# EAGLE design mojo-basler-shield (EAGLE 8.6.1)
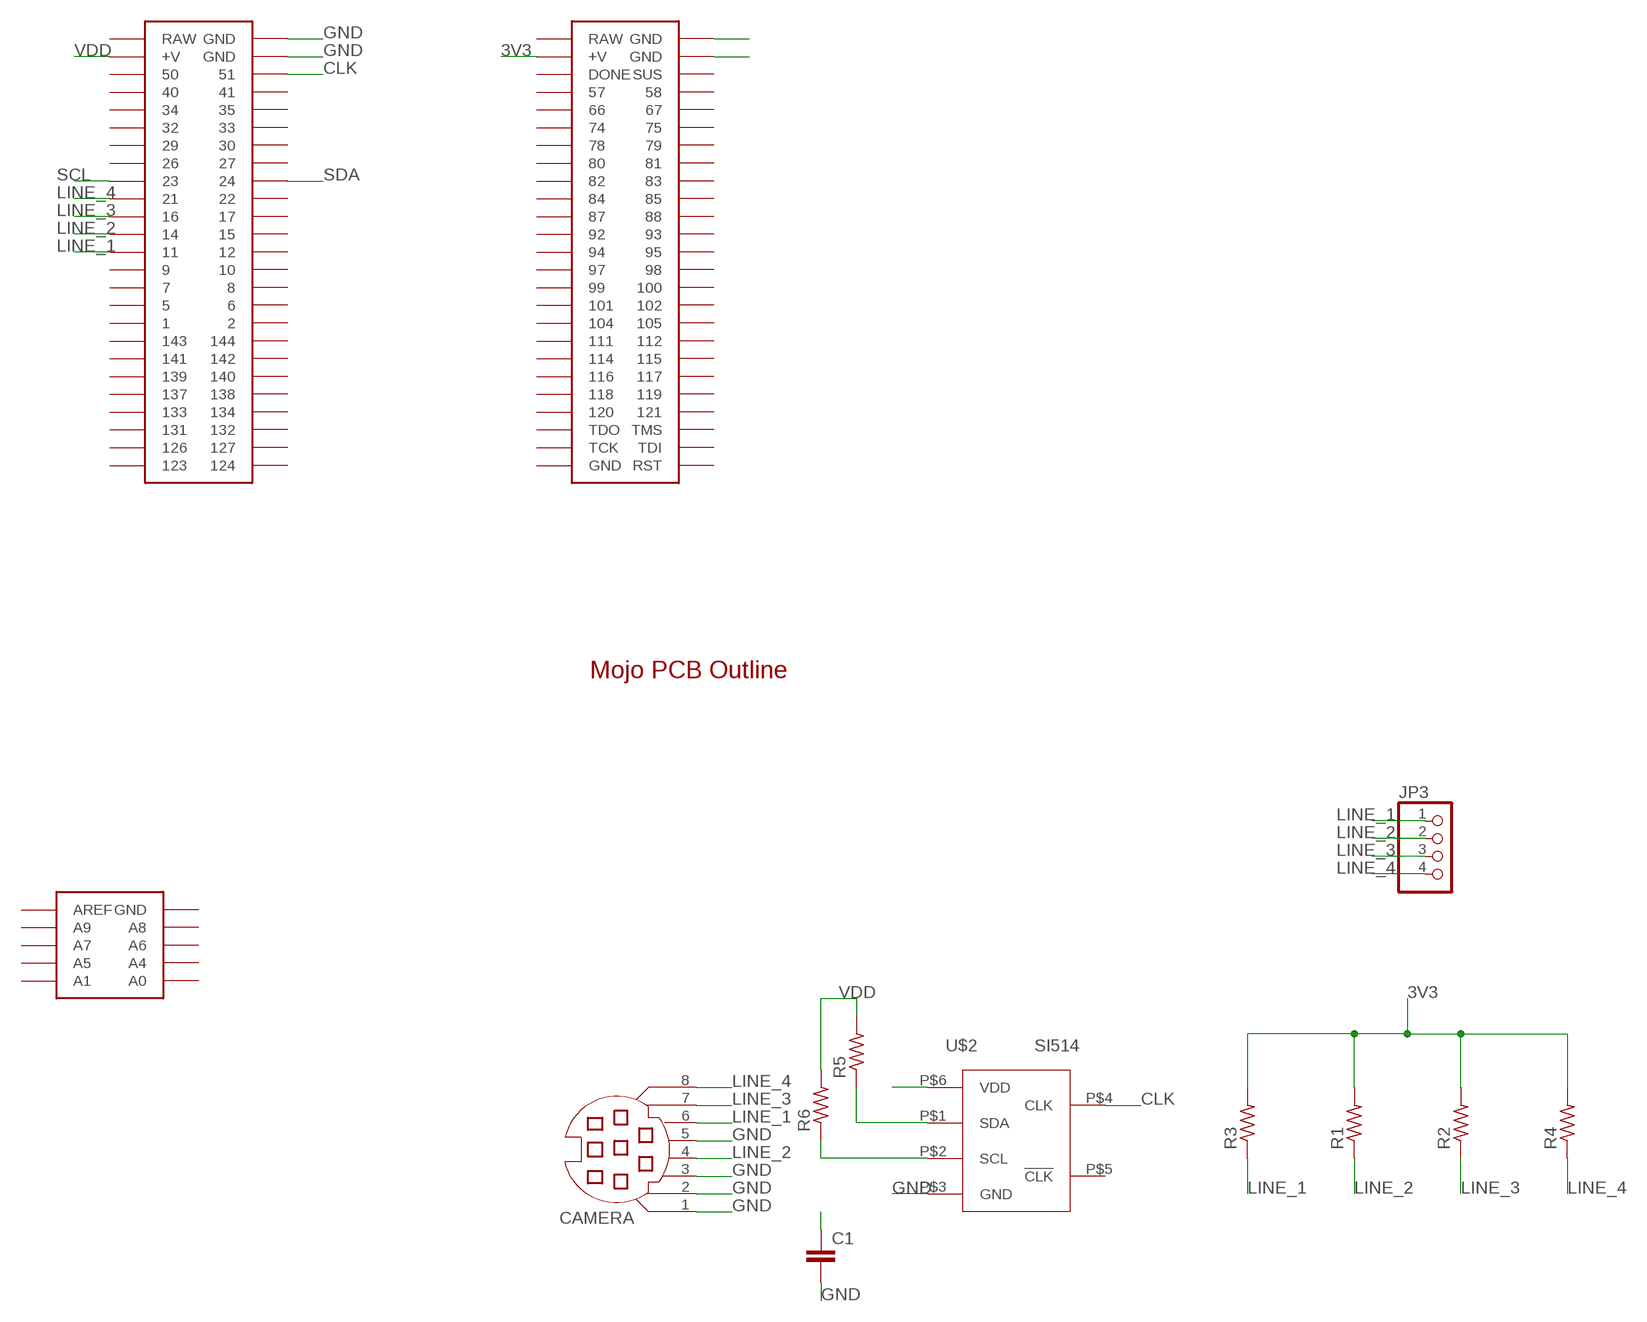
[diagram p0: schematic, sheet 1]

## Parts
C1  C-EUC0603  [C0603]
CAMERA  MD08SS  [MDIN08SS]
JP3  PINHD-1X4  [1X04]
R1  R-US_R0603  [R0603]
R2  R-US_R0603  [R0603]
R3  R-US_R0603  [R0603]
R4  R-US_R0603  [R0603]
R5  R-US_R0603  [R0603]
R6  R-US_R0603  [R0603]
U$1  MOJO_OUTLINE  [MOJO_OUTLINE]
U$2  SI514  [XTAL-6PIN]
U$3  MOJOV3  [MOJO_V3]

## Nets
3V3: R1.2 R2.2 R3.2 R4.2 U$3.V@2(+V)
CLK: U$2.P$4(CLK) U$3.51
GND: C1.2 CAMERA.1 CAMERA.2 CAMERA.3 CAMERA.5 U$2.P$3(GND) U$3.GND@1(GND) U$3.GND@2(GND) U$3.GND@3(GND) U$3.GND@4(GND)
LINE_1: CAMERA.6 JP3.1 R3.1 U$3.11
LINE_2: CAMERA.4 JP3.2 R1.1 U$3.14
LINE_3: CAMERA.7 JP3.3 R2.1 U$3.16
LINE_4: CAMERA.8 JP3.4 R4.1 U$3.21
SCL: R6.1 U$2.P$2(SCL) U$3.23
SDA: R5.1 U$2.P$1(SDA) U$3.24
VDD: C1.1 R5.2 R6.2 U$2.P$6(VDD) U$3.V@1(+V)
Unconnected: U$2.P$5(!CLK) U$3.1 U$3.2 U$3.5 U$3.6 U$3.7 U$3.8 U$3.9 U$3.10 U$3.12 U$3.15 U$3.17 U$3.22 U$3.26 U$3.27 U$3.29 U$3.30 U$3.32 U$3.33 U$3.34 U$3.35 U$3.40 U$3.41 U$3.50 U$3.57 U$3.58 U$3.66 U$3.67 U$3.74 U$3.75 U$3.78 U$3.79 U$3.80 U$3.81 U$3.82 U$3.83 U$3.84 U$3.85 U$3.87 U$3.88 U$3.92 U$3.93 U$3.94 U$3.95 U$3.97 U$3.98 U$3.99 U$3.100 U$3.101 U$3.102 U$3.104 U$3.105 U$3.111 U$3.112 U$3.114 U$3.115 U$3.116 U$3.117 U$3.118 U$3.119 U$3.120 U$3.121 U$3.123 U$3.124 U$3.126 U$3.127 U$3.131 U$3.132 U$3.133 U$3.134 U$3.137 U$3.138 U$3.139 U$3.140 U$3.141 U$3.142 U$3.143 U$3.144 U$3.A0 U$3.A1 U$3.A4 U$3.A5 U$3.A6 U$3.A7 U$3.A8 U$3.A9 U$3.AREF U$3.DONE U$3.GND@5(GND) U$3.GND@6(GND) U$3.RAW@1(RAW) U$3.RAW@2(RAW) U$3.RST U$3.SUS U$3.TCK U$3.TDI U$3.TDO U$3.TMS

## Library data of the parts
C1 = rcl:C-EU: CAPACITOR, European symbol; SPICEPREFIX: C
CAMERA = con-yamaichi:MD08SS: YAMAICHI CONNECTOR; OC_FARNELL: unknown; OC_NEWARK: unknown
JP3 = pinhead:PINHD-1X4: PIN HEADER
R1-R6 = rcl:R-US_: RESISTOR, American symbol; SPICEPREFIX: R
U$1 = EmbeddedMicro-Mojo:MOJO_OUTLINE
U$2 = lupa300-components:SI514
U$3 = EmbeddedMicro-Mojo:MOJO

## Board
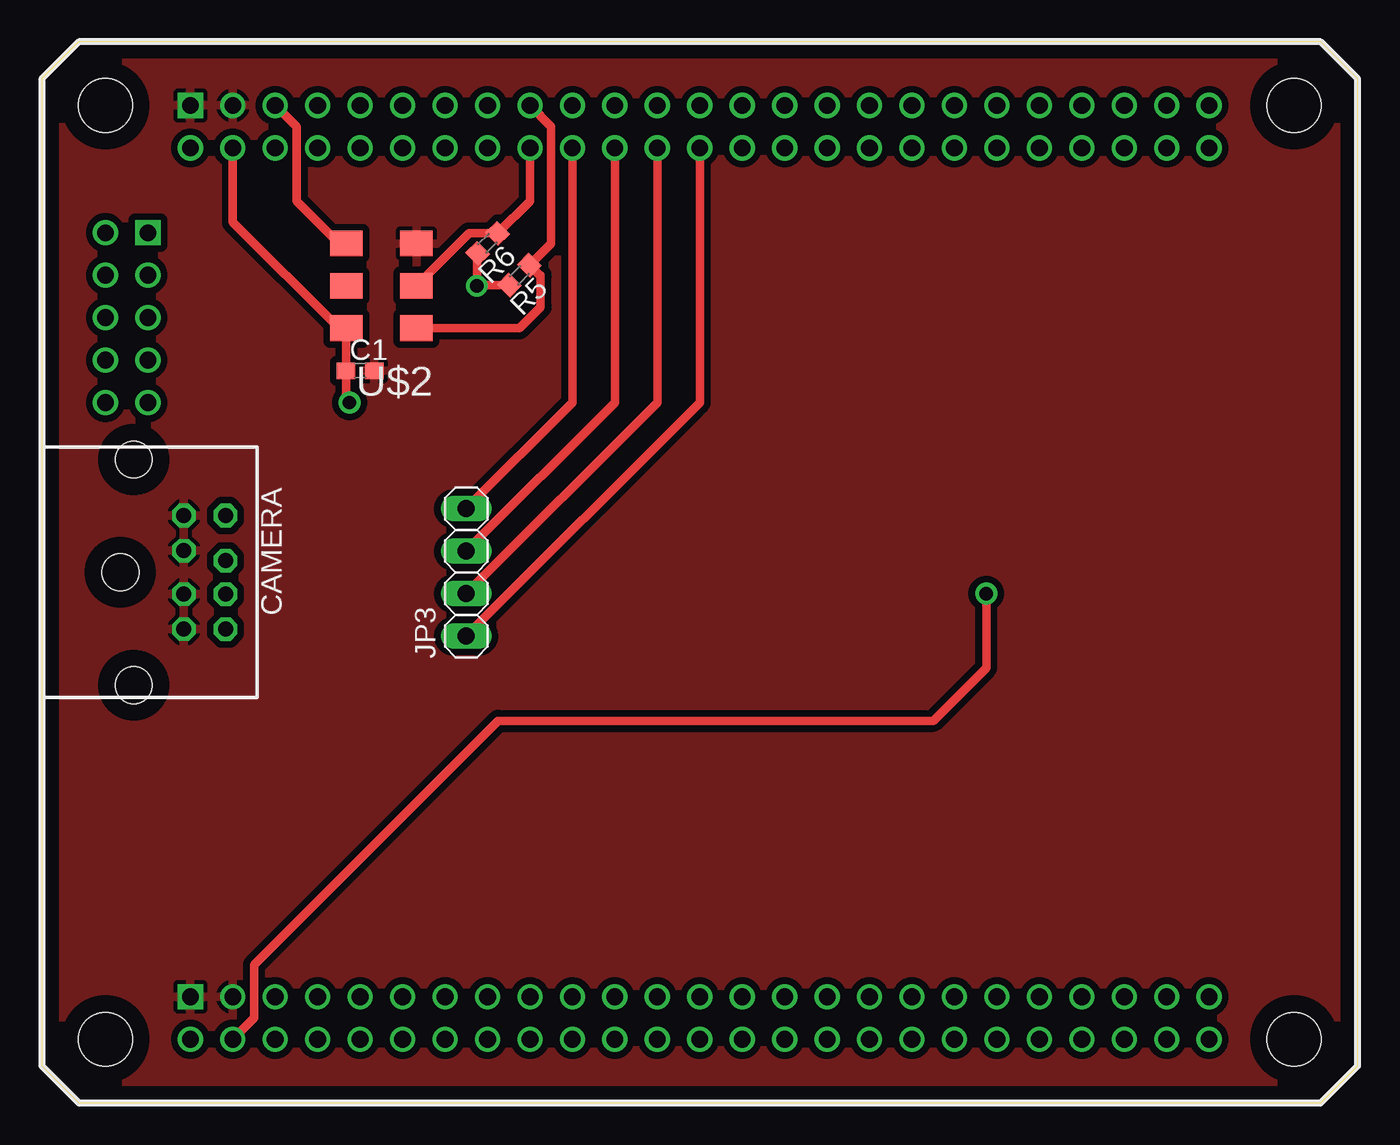
[diagram p1: board, top side]
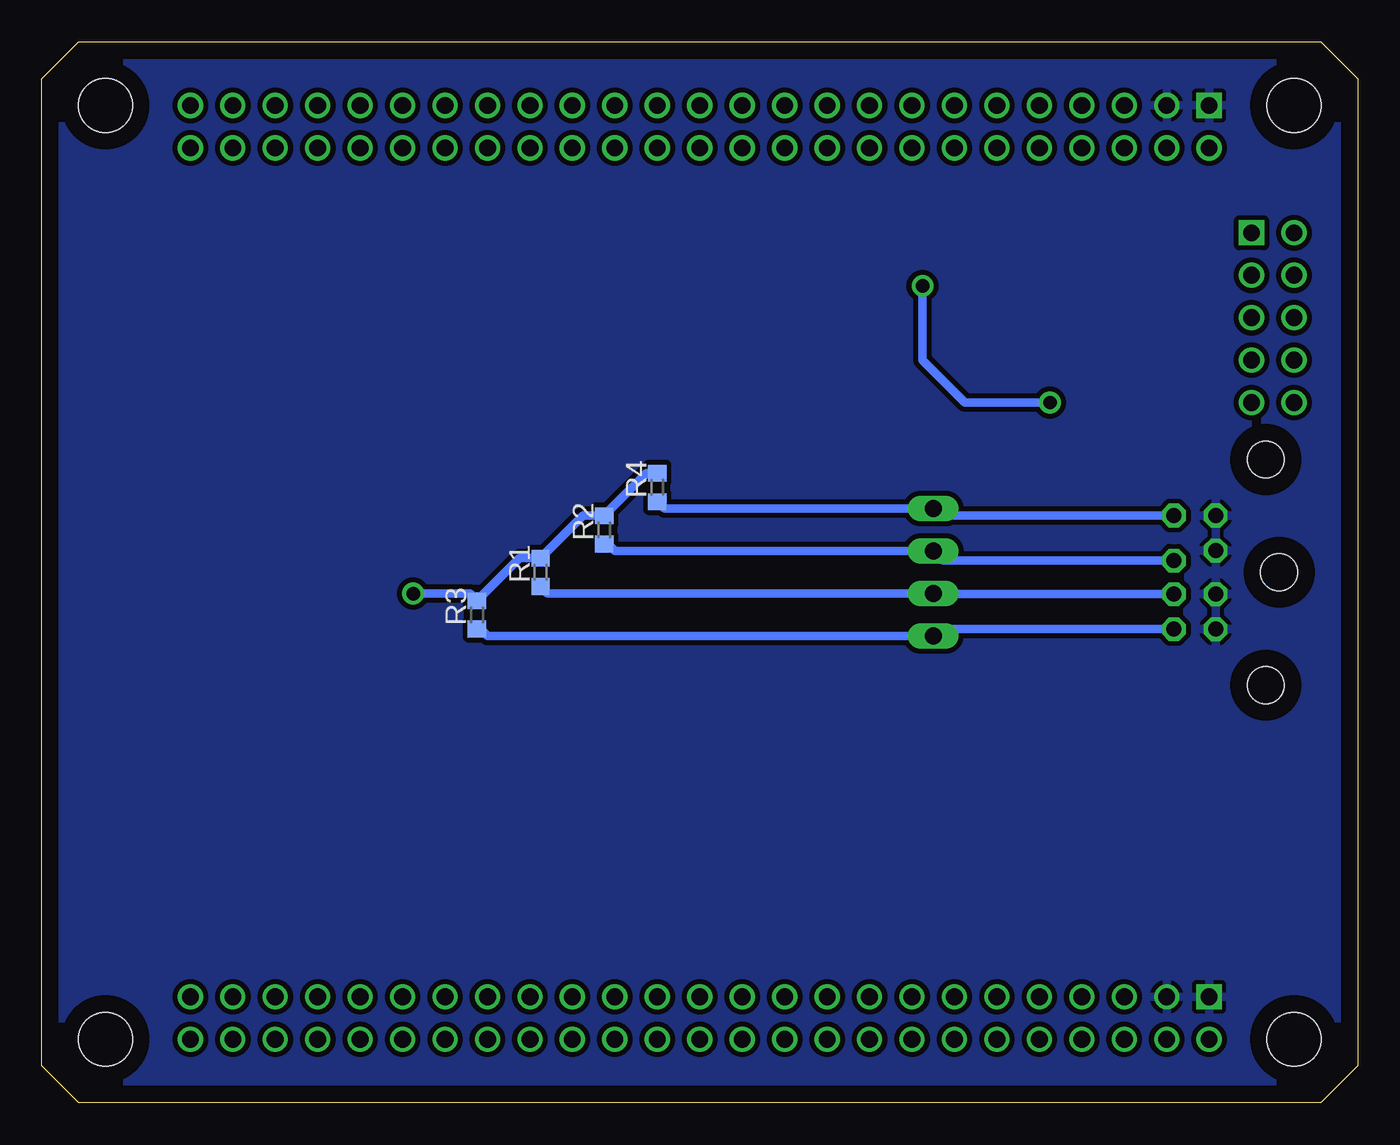
[diagram p2: board, bottom side, seen from below]

Size 78.74 x 63.5 mm. Coordinates in mm from the lower left corner, seen from the top.
Copper layers (1*16): Top 0.035mm / dielectric 1.5mm / Bottom 0.035mm
Design rules "default": minimum track width 6mil, minimum drill 0.35mm, track to track 6mil, track to pad 6mil, pad to pad 6mil, via to via 6mil, smd to smd 6mil, copper to edge 40mil, drill to drill 6mil, minimum pad ring 10mil, minimum via ring 8mil, stop-mask expansion 4mil, vias tented up to drill 0mil, thermal gap 10mil

### Footprints (pad centres in the part's own frame; a part is rotated, then mirrored left to right if it is on the bottom)
C0603 = smd 1.1 x 1: 1 -0.85,0; 2 0.85,0
MDIN08SS = drill 0.9 octagon: 1 1.3,8.5; 2 -1.3,8.5; 3 3.4,8.5; 4 1.3,11; 5 -3.4,8.5; 6 3.4,11; 7 -0.7,11; 8 -3.4,11 | hole 2.2: -6.75,5.5; 0,4.7; 6.75,5.5
1X04 = drill 1.016 long: 1 -3.81,0; 2 -1.27,0; 3 1.27,0; 4 3.81,0
R0603 = smd 1 x 1.1: 1 -0.85,0; 2 0.85,0
XTAL-6PIN = smd 1.95 x 1.55: P$1 -2.1,2.54; P$2 -2.1,0; P$3 -2.1,-2.54; P$4 2.1,-2.54; P$5 2.1,0; P$6 2.1,2.54
MOJO_V3 = drill 1: 1 49.53,57.15; 2 49.53,59.69; 5 46.99,57.15; 6 46.99,59.69; 7 44.45,57.15; 8 44.45,59.69; 9 41.91,57.15; 10 41.91,59.69; 11 39.37,57.15; 12 39.37,59.69; 14 36.83,57.15; 15 36.83,59.69; 16 34.29,57.15; 17 34.29,59.69; 21 31.75,57.15; 22 31.75,59.69; 23 29.21,57.15; 24 29.21,59.69; 26 26.67,57.15; 27 26.67,59.69; 29 24.13,57.15; 30 24.13,59.69; 32 21.59,57.15; 33 21.59,59.69; 34 19.05,57.15; 35 19.05,59.69; 40 16.51,57.15; 41 16.51,59.69; 50 13.97,57.15; 51 13.97,59.69; 57 16.51,3.81; 58 16.51,6.35; 66 19.05,3.81; 67 19.05,6.35; 74 21.59,3.81; 75 21.59,6.35; 78 24.13,3.81; 79 24.13,6.35; 80 26.67,3.81; 81 26.67,6.35; 82 29.21,3.81; 83 29.21,6.35; 84 31.75,3.81; 85 31.75,6.35; 87 34.29,3.81; 88 34.29,6.35; 92 36.83,3.81; 93 36.83,6.35; 94 39.37,3.81; 95 39.37,6.35; 97 41.91,3.81; 98 41.91,6.35; 99 44.45,3.81; 100 44.45,6.35; 101 46.99,3.81; 102 46.99,6.35; 104 49.53,3.81; 105 49.53,6.35; 111 52.07,3.81; 112 52.07,6.35; 114 54.61,3.81; 115 54.61,6.35; 116 57.15,3.81; 117 57.15,6.35; 118 59.69,3.81; 119 59.69,6.35; 120 62.23,3.81; 121 62.23,6.35; 123 69.85,57.15; 124 69.85,59.69; 126 67.31,57.15; 127 67.31,59.69; 131 64.77,57.15; 132 64.77,59.69; 133 62.23,57.15; 134 62.23,59.69; 137 59.69,57.15; 138 59.69,59.69; 139 57.15,57.15; 140 57.15,59.69; 141 54.61,57.15; 142 54.61,59.69; 143 52.07,57.15; 144 52.07,59.69; A0 6.35,41.91; A1 3.81,41.91; A4 6.35,44.45; A5 3.81,44.45; A6 6.35,46.99; A7 3.81,46.99; A8 6.35,49.53; A9 3.81,49.53; AREF 3.81,52.07; DONE 13.97,3.81; GND@2 11.43,59.69; GND@4 11.43,6.35; GND@6 69.85,3.81; RAW@1 8.89,57.15; RAW@2 8.89,3.81; RST 69.85,6.35; SUS 13.97,6.35; TCK 67.31,3.81; TDI 67.31,6.35; TDO 64.77,3.81; TMS 64.77,6.35; V@1 11.43,57.15; V@2 11.43,3.81 | drill 1 square: GND@1 8.89,59.69; GND@3 8.89,6.35; GND@5 6.35,52.07 | hole 3.2: 3.81,3.81; 3.81,59.69; 74.93,59.69; 74.93,3.81

### Placement (x,y rotation side)
C1  19.05,43.81 0 top
CAMERA  0,31.75 270 top
JP3  25.4,31.75 90 top
R1  48.9,31.75 90 bottom
R2  45.09,34.29 90 bottom
R3  52.7,29.21 90 bottom
R4  41.91,36.83 90 bottom
R5  28.57,49.53 225 top
R6  26.67,51.44 225 top
U$1  0,0 0 top
U$2  20.32,48.9 180 top
U$3  0,0 0 top

### Tracks (layer width: path | path; a pad name or v marks a point on that pad's centre or on a via)
3V3  (via drill 0.8 pad 1.3)
  Top 0.508: U$3.V@2 12.7,5.08 12.7,8.26 27.3,22.86 53.34,22.86 56.52,26.04 v56.52,30.48
  Bottom 0.508: v56.52,30.48 53.12,30.48 R3.2 50.16,32.6 R1.2 46.35,35.14 R2.2 42.55,37.68 R4.2
CLK
  Top 0.508: U$3.51 15.24,58.42 15.24,53.98 17.78,51.44 U$2.P$4
GND
  pour Top (isolate 0.406): 0,61.59 1.91,63.5 76.83,63.5 78.74,61.59 78.74,2.54 78.74,1.91 76.83,0 2.54,0 0,2.54
  pour Bottom (isolate 0.305): 0,61.59 1.91,63.5 76.2,63.5 78.74,60.96 78.74,2.54 78.74,1.91 76.83,0 2.54,0 0,2.54
LINE_1
  Top 0.508: JP3.1 39.37,41.91 U$3.11
  Bottom 0.508: CAMERA.6 24.99,28.35 JP3.1 52.07,27.94 52.49,28.36 R3.1
LINE_2
  Top 0.508: JP3.2 36.83,41.91 U$3.14
  Bottom 0.508: CAMERA.4 25.37,30.45 JP3.2 48.48,30.48 R1.1
LINE_3
  Top 0.508: JP3.3 34.29,41.91 U$3.16
  Bottom 0.508: CAMERA.7 24.83,32.45 JP3.3 44.45,33.02 44.87,33.44 R2.1
LINE_4
  Top 0.508: JP3.4 31.75,41.91 U$3.21
  Bottom 0.508: CAMERA.8 24.99,35.15 JP3.4 41.49,35.56 R4.1
SCL
  Top 0.508: U$2.P$2 25.56,52.04 R6.1 29.21,53.98 U$3.23
SDA
  Top 0.406: 29.84,49.53 29.78,49.53
  Top 0.508: U$2.P$1 28.57,46.35 29.84,47.62 29.84,49.53 | 29.78,49.53 R5.1 30.48,51.44 30.48,58.42 U$3.24
VDD  (via drill 0.8 pad 1.3)
  Top 0.508: U$3.V@1 11.43,52.7 17.78,46.35 | 17.78,46.35 U$2.P$6 18.22,44.43 C1.1 | 17.78,46.35 17.57,46.35 | R6.2 26.04,50.8 v26.04,48.9 26.07,48.93 R5.2 | C1.1 18.2,43.4 | C1.1 18.2,42.12 v18.41,41.91
  Bottom 0.508: v18.41,41.91 23.5,41.91 26.04,44.45 v26.04,48.9